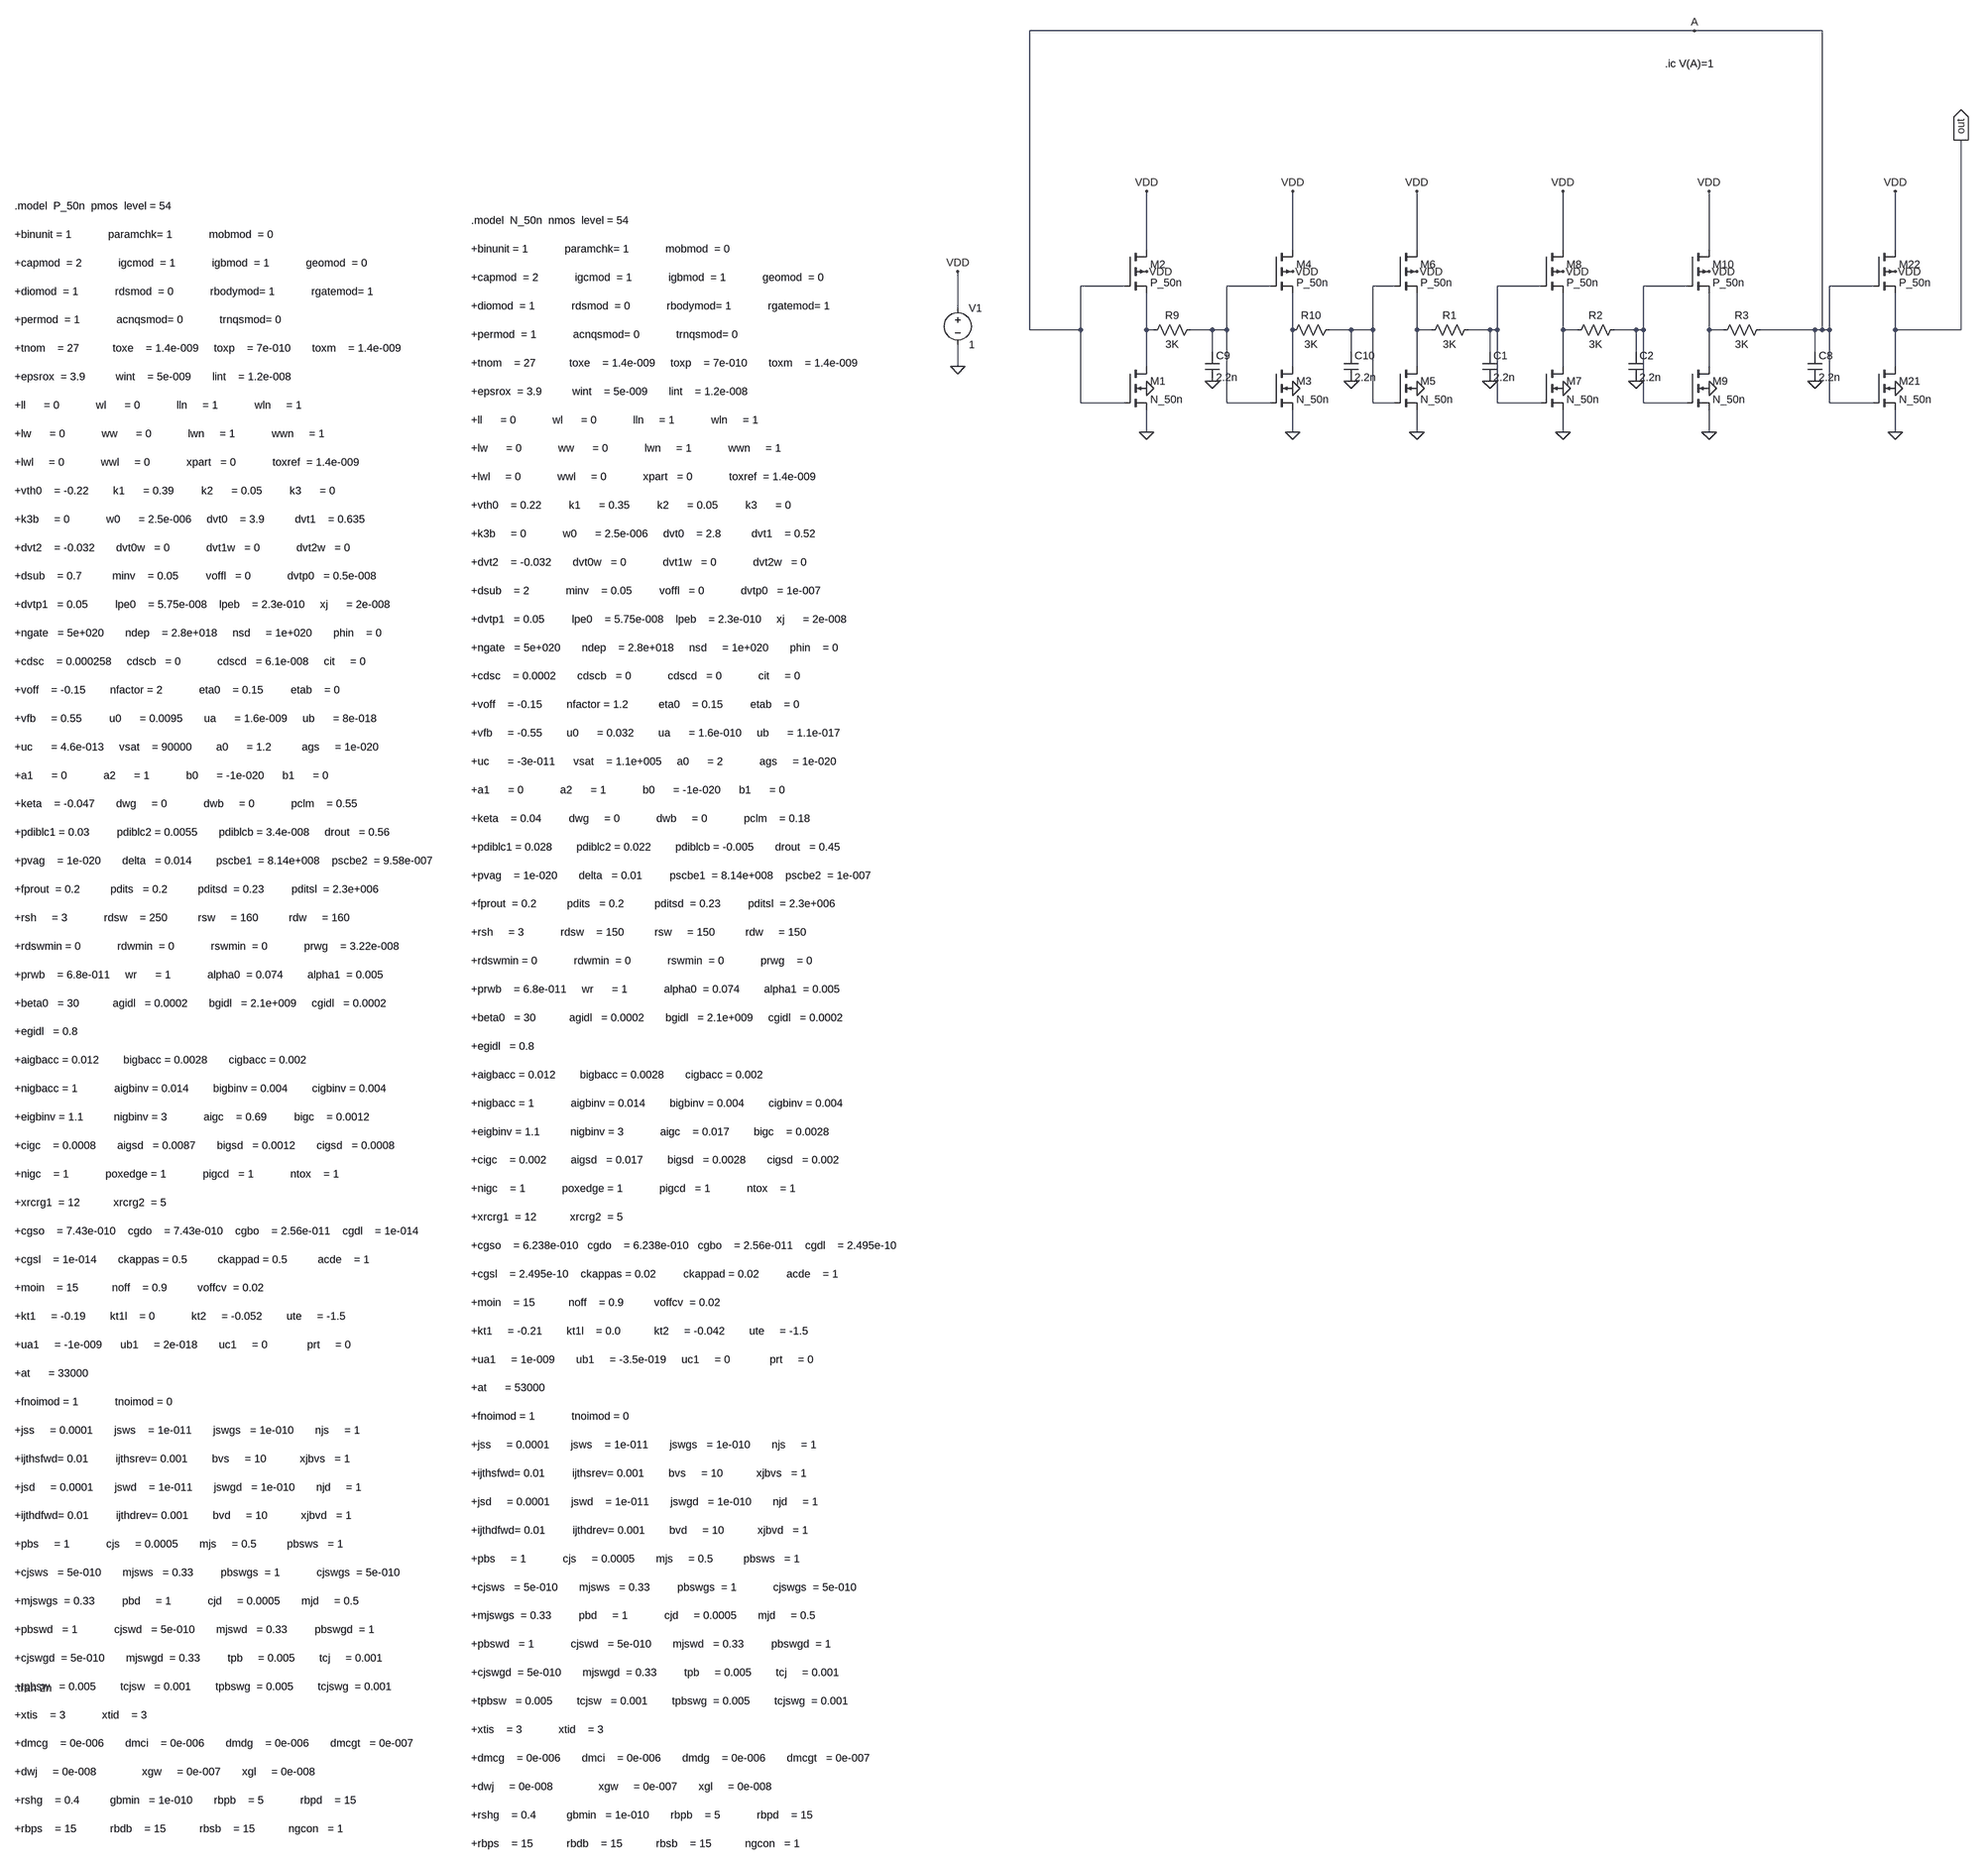
[diagram p0: schematic Draft30.asc]
Draft30.asc, the LTspice schematic file:
Version 4
SHEET 1 4736 3280
WIRE 2672 -368 1216 -368
WIRE 4352 -368 2672 -368
WIRE 1472 112 1472 -16
WIRE 1792 112 1792 -16
WIRE 2064 112 2064 -16
WIRE 2384 112 2384 -16
WIRE 2704 112 2704 -16
WIRE 4512 112 4512 -16
WIRE 1424 192 1328 192
WIRE 1744 192 1648 192
WIRE 2016 192 1968 192
WIRE 2336 192 2240 192
WIRE 2656 192 2560 192
WIRE 4464 192 4368 192
WIRE 1040 240 1040 160
WIRE 1216 288 1216 -368
WIRE 1328 288 1328 192
WIRE 1328 288 1216 288
WIRE 1472 288 1472 208
WIRE 1488 288 1472 288
WIRE 1616 288 1568 288
WIRE 1648 288 1648 192
WIRE 1648 288 1616 288
WIRE 1792 288 1792 208
WIRE 1920 288 1872 288
WIRE 1968 288 1968 192
WIRE 1968 288 1920 288
WIRE 2064 288 2064 208
WIRE 2096 288 2064 288
WIRE 2224 288 2176 288
WIRE 2240 288 2240 192
WIRE 2240 288 2224 288
WIRE 2384 288 2384 208
WIRE 2416 288 2384 288
WIRE 2544 288 2496 288
WIRE 2560 288 2560 192
WIRE 2560 288 2544 288
WIRE 2704 288 2704 208
WIRE 2736 288 2704 288
WIRE 4336 288 2816 288
WIRE 4352 288 4352 -368
WIRE 4352 288 4336 288
WIRE 4368 288 4368 192
WIRE 4368 288 4352 288
WIRE 4512 288 4512 208
WIRE 4656 288 4656 -128
WIRE 4656 288 4512 288
WIRE 1616 336 1616 288
WIRE 1920 336 1920 288
WIRE 2224 336 2224 288
WIRE 2544 336 2544 288
WIRE 4336 336 4336 288
WIRE 1040 368 1040 320
WIRE 1472 368 1472 288
WIRE 1792 368 1792 288
WIRE 2064 368 2064 288
WIRE 2384 368 2384 288
WIRE 2704 368 2704 288
WIRE 4512 368 4512 288
WIRE 1328 448 1328 288
WIRE 1424 448 1328 448
WIRE 1648 448 1648 288
WIRE 1744 448 1648 448
WIRE 1968 448 1968 288
WIRE 2016 448 1968 448
WIRE 2240 448 2240 288
WIRE 2336 448 2240 448
WIRE 2560 448 2560 288
WIRE 2656 448 2560 448
WIRE 4368 448 4368 288
WIRE 4464 448 4368 448
WIRE 1472 512 1472 464
WIRE 1792 512 1792 464
WIRE 2064 512 2064 464
WIRE 2384 512 2384 464
WIRE 2704 512 2704 464
WIRE 4512 512 4512 464
FLAG 1040 368 0
FLAG 1472 512 0
FLAG 1472 416 0
FLAG 1040 160 VDD
FLAG 1472 160 VDD
FLAG 1472 -16 VDD
FLAG 1792 512 0
FLAG 1792 416 0
FLAG 1792 160 VDD
FLAG 1792 -16 VDD
FLAG 2064 512 0
FLAG 2064 416 0
FLAG 2064 160 VDD
FLAG 2064 -16 VDD
FLAG 2384 512 0
FLAG 2384 416 0
FLAG 2384 160 VDD
FLAG 2384 -16 VDD
FLAG 2704 512 0
FLAG 2704 416 0
FLAG 2704 160 VDD
FLAG 2704 -16 VDD
FLAG 4512 512 0
FLAG 4512 416 0
FLAG 4512 160 VDD
FLAG 4512 -16 VDD
FLAG 2672 -368 A
FLAG 2224 400 0
FLAG 2544 400 0
FLAG 4336 400 0
FLAG 1616 400 0
FLAG 1920 400 0
FLAG 4656 -128 out
IOPIN 4656 -128 Out
SYMBOL nmos4 1424 368 R0
SYMATTR InstName M1
SYMATTR Value N_50n
SYMATTR Value2 l=50N w=500N
SYMBOL pmos4 1424 112 R0
SYMATTR InstName M2
SYMATTR Value P_50n
SYMATTR Value2 l=50N w=1U
SYMBOL voltage 1040 224 R0
WINDOW 123 0 0 Left 0
WINDOW 39 0 0 Left 0
SYMATTR InstName V1
SYMATTR Value 1
SYMBOL nmos4 1744 368 R0
SYMATTR InstName M3
SYMATTR Value N_50n
SYMATTR Value2 l=50N w=500N
SYMBOL pmos4 1744 112 R0
SYMATTR InstName M4
SYMATTR Value P_50n
SYMATTR Value2 l=50N w=1U
SYMBOL nmos4 2016 368 R0
SYMATTR InstName M5
SYMATTR Value N_50n
SYMATTR Value2 l=50N w=500N
SYMBOL pmos4 2016 112 R0
SYMATTR InstName M6
SYMATTR Value P_50n
SYMATTR Value2 l=50N w=1U
SYMBOL nmos4 2336 368 R0
SYMATTR InstName M7
SYMATTR Value N_50n
SYMATTR Value2 l=50N w=500N
SYMBOL pmos4 2336 112 R0
SYMATTR InstName M8
SYMATTR Value P_50n
SYMATTR Value2 l=50N w=1U
SYMBOL nmos4 2656 368 R0
SYMATTR InstName M9
SYMATTR Value N_50n
SYMATTR Value2 l=50N w=500N
SYMBOL pmos4 2656 112 R0
SYMATTR InstName M10
SYMATTR Value P_50n
SYMATTR Value2 l=50N w=1U
SYMBOL nmos4 4464 368 R0
SYMATTR InstName M21
SYMATTR Value N_50n
SYMATTR Value2 l=50N w=500N
SYMBOL pmos4 4464 112 R0
SYMATTR InstName M22
SYMATTR Value P_50n
SYMATTR Value2 l=50N w=1U
SYMBOL res 2192 272 R90
WINDOW 0 0 56 VBottom 2
WINDOW 3 32 56 VTop 2
SYMATTR InstName R1
SYMATTR Value 3K
SYMBOL cap 2208 336 R0
SYMATTR InstName C1
SYMATTR Value 2.2n
SYMBOL res 2512 272 R90
WINDOW 0 0 56 VBottom 2
WINDOW 3 32 56 VTop 2
SYMATTR InstName R2
SYMATTR Value 3K
SYMBOL cap 2528 336 R0
SYMATTR InstName C2
SYMATTR Value 2.2n
SYMBOL res 2832 272 R90
WINDOW 0 0 56 VBottom 2
WINDOW 3 32 56 VTop 2
SYMATTR InstName R3
SYMATTR Value 3K
SYMBOL cap 4320 336 R0
SYMATTR InstName C8
SYMATTR Value 2.2n
SYMBOL res 1584 272 R90
WINDOW 0 0 56 VBottom 2
WINDOW 3 32 56 VTop 2
SYMATTR InstName R9
SYMATTR Value 3K
SYMBOL cap 1600 336 R0
SYMATTR InstName C9
SYMATTR Value 2.2n
SYMBOL res 1888 272 R90
WINDOW 0 0 56 VBottom 2
WINDOW 3 32 56 VTop 2
SYMATTR InstName R10
SYMATTR Value 3K
SYMBOL cap 1904 336 R0
SYMATTR InstName C10
SYMATTR Value 2.2n
TEXT -184 48 Left 2 !.model  N_50n  nmos  level = 54\n \n+binunit = 1            paramchk= 1            mobmod  = 0          \n \n+capmod  = 2            igcmod  = 1            igbmod  = 1            geomod  = 0          \n \n+diomod  = 1            rdsmod  = 0            rbodymod= 1            rgatemod= 1          \n \n+permod  = 1            acnqsmod= 0            trnqsmod= 0          \n \n+tnom    = 27           toxe    = 1.4e-009     toxp    = 7e-010       toxm    = 1.4e-009   \n \n+epsrox  = 3.9          wint    = 5e-009       lint    = 1.2e-008   \n \n+ll      = 0            wl      = 0            lln     = 1            wln     = 1          \n \n+lw      = 0            ww      = 0            lwn     = 1            wwn     = 1          \n \n+lwl     = 0            wwl     = 0            xpart   = 0            toxref  = 1.4e-009   \n \n+vth0    = 0.22         k1      = 0.35         k2      = 0.05         k3      = 0          \n \n+k3b     = 0            w0      = 2.5e-006     dvt0    = 2.8          dvt1    = 0.52       \n \n+dvt2    = -0.032       dvt0w   = 0            dvt1w   = 0            dvt2w   = 0          \n \n+dsub    = 2            minv    = 0.05         voffl   = 0            dvtp0   = 1e-007     \n \n+dvtp1   = 0.05         lpe0    = 5.75e-008    lpeb    = 2.3e-010     xj      = 2e-008     \n \n+ngate   = 5e+020       ndep    = 2.8e+018     nsd     = 1e+020       phin    = 0          \n \n+cdsc    = 0.0002       cdscb   = 0            cdscd   = 0            cit     = 0          \n \n+voff    = -0.15        nfactor = 1.2          eta0    = 0.15         etab    = 0          \n \n+vfb     = -0.55        u0      = 0.032        ua      = 1.6e-010     ub      = 1.1e-017   \n \n+uc      = -3e-011      vsat    = 1.1e+005     a0      = 2            ags     = 1e-020     \n \n+a1      = 0            a2      = 1            b0      = -1e-020      b1      = 0          \n \n+keta    = 0.04         dwg     = 0            dwb     = 0            pclm    = 0.18       \n \n+pdiblc1 = 0.028        pdiblc2 = 0.022        pdiblcb = -0.005       drout   = 0.45       \n \n+pvag    = 1e-020       delta   = 0.01         pscbe1  = 8.14e+008    pscbe2  = 1e-007     \n \n+fprout  = 0.2          pdits   = 0.2          pditsd  = 0.23         pditsl  = 2.3e+006   \n \n+rsh     = 3            rdsw    = 150          rsw     = 150          rdw     = 150        \n \n+rdswmin = 0            rdwmin  = 0            rswmin  = 0            prwg    = 0          \n \n+prwb    = 6.8e-011     wr      = 1            alpha0  = 0.074        alpha1  = 0.005      \n \n+beta0   = 30           agidl   = 0.0002       bgidl   = 2.1e+009     cgidl   = 0.0002     \n \n+egidl   = 0.8          \n \n+aigbacc = 0.012        bigbacc = 0.0028       cigbacc = 0.002\n \n+nigbacc = 1            aigbinv = 0.014        bigbinv = 0.004        cigbinv = 0.004\n \n+eigbinv = 1.1          nigbinv = 3            aigc    = 0.017        bigc    = 0.0028\n \n+cigc    = 0.002        aigsd   = 0.017        bigsd   = 0.0028       cigsd   = 0.002\n \n+nigc    = 1            poxedge = 1            pigcd   = 1            ntox    = 1\n \n+xrcrg1  = 12           xrcrg2  = 5          \n \n+cgso    = 6.238e-010   cgdo    = 6.238e-010   cgbo    = 2.56e-011    cgdl    = 2.495e-10     \n \n+cgsl    = 2.495e-10    ckappas = 0.02         ckappad = 0.02         acde    = 1          \n \n+moin    = 15           noff    = 0.9          voffcv  = 0.02       \n \n+kt1     = -0.21        kt1l    = 0.0           kt2     = -0.042        ute     = -1.5\n \n+ua1     = 1e-009       ub1     = -3.5e-019     uc1     = 0             prt     = 0\n \n+at      = 53000\n \n+fnoimod = 1            tnoimod = 0          \n \n+jss     = 0.0001       jsws    = 1e-011       jswgs   = 1e-010       njs     = 1          \n \n+ijthsfwd= 0.01         ijthsrev= 0.001        bvs     = 10           xjbvs   = 1          \n \n+jsd     = 0.0001       jswd    = 1e-011       jswgd   = 1e-010       njd     = 1          \n \n+ijthdfwd= 0.01         ijthdrev= 0.001        bvd     = 10           xjbvd   = 1          \n \n+pbs     = 1            cjs     = 0.0005       mjs     = 0.5          pbsws   = 1          \n \n+cjsws   = 5e-010       mjsws   = 0.33         pbswgs  = 1            cjswgs  = 5e-010     \n \n+mjswgs  = 0.33         pbd     = 1            cjd     = 0.0005       mjd     = 0.5        \n \n+pbswd   = 1            cjswd   = 5e-010       mjswd   = 0.33         pbswgd  = 1          \n \n+cjswgd  = 5e-010       mjswgd  = 0.33         tpb     = 0.005        tcj     = 0.001      \n \n+tpbsw   = 0.005        tcjsw   = 0.001        tpbswg  = 0.005        tcjswg  = 0.001      \n \n+xtis    = 3            xtid    = 3          \n \n+dmcg    = 0e-006       dmci    = 0e-006       dmdg    = 0e-006       dmcgt   = 0e-007     \n \n+dwj     = 0e-008               xgw     = 0e-007       xgl     = 0e-008     \n \n+rshg    = 0.4          gbmin   = 1e-010       rbpb    = 5            rbpd    = 15         \n \n+rbps    = 15           rbdb    = 15           rbsb    = 15           ngcon   = 1
TEXT 2608 -296 Left 2 !.ic V(A)=1
TEXT -1184 16 Left 2 !.model  P_50n  pmos  level = 54\n \n+binunit = 1            paramchk= 1            mobmod  = 0          \n \n+capmod  = 2            igcmod  = 1            igbmod  = 1            geomod  = 0          \n \n+diomod  = 1            rdsmod  = 0            rbodymod= 1            rgatemod= 1          \n \n+permod  = 1            acnqsmod= 0            trnqsmod= 0          \n \n+tnom    = 27           toxe    = 1.4e-009     toxp    = 7e-010       toxm    = 1.4e-009   \n \n+epsrox  = 3.9          wint    = 5e-009       lint    = 1.2e-008   \n \n+ll      = 0            wl      = 0            lln     = 1            wln     = 1          \n \n+lw      = 0            ww      = 0            lwn     = 1            wwn     = 1          \n \n+lwl     = 0            wwl     = 0            xpart   = 0            toxref  = 1.4e-009   \n \n+vth0    = -0.22        k1      = 0.39         k2      = 0.05         k3      = 0          \n \n+k3b     = 0            w0      = 2.5e-006     dvt0    = 3.9          dvt1    = 0.635        \n \n+dvt2    = -0.032       dvt0w   = 0            dvt1w   = 0            dvt2w   = 0          \n \n+dsub    = 0.7          minv    = 0.05         voffl   = 0            dvtp0   = 0.5e-008     \n \n+dvtp1   = 0.05         lpe0    = 5.75e-008    lpeb    = 2.3e-010     xj      = 2e-008     \n \n+ngate   = 5e+020       ndep    = 2.8e+018     nsd     = 1e+020       phin    = 0          \n \n+cdsc    = 0.000258     cdscb   = 0            cdscd   = 6.1e-008     cit     = 0          \n \n+voff    = -0.15        nfactor = 2            eta0    = 0.15         etab    = 0          \n \n+vfb     = 0.55         u0      = 0.0095       ua      = 1.6e-009     ub      = 8e-018     \n \n+uc      = 4.6e-013     vsat    = 90000        a0      = 1.2          ags     = 1e-020     \n \n+a1      = 0            a2      = 1            b0      = -1e-020      b1      = 0          \n \n+keta    = -0.047       dwg     = 0            dwb     = 0            pclm    = 0.55       \n \n+pdiblc1 = 0.03         pdiblc2 = 0.0055       pdiblcb = 3.4e-008     drout   = 0.56       \n \n+pvag    = 1e-020       delta   = 0.014        pscbe1  = 8.14e+008    pscbe2  = 9.58e-007  \n \n+fprout  = 0.2          pdits   = 0.2          pditsd  = 0.23         pditsl  = 2.3e+006   \n \n+rsh     = 3            rdsw    = 250          rsw     = 160          rdw     = 160        \n \n+rdswmin = 0            rdwmin  = 0            rswmin  = 0            prwg    = 3.22e-008  \n \n+prwb    = 6.8e-011     wr      = 1            alpha0  = 0.074        alpha1  = 0.005      \n \n+beta0   = 30           agidl   = 0.0002       bgidl   = 2.1e+009     cgidl   = 0.0002     \n \n+egidl   = 0.8          \n \n+aigbacc = 0.012        bigbacc = 0.0028       cigbacc = 0.002\n \n+nigbacc = 1            aigbinv = 0.014        bigbinv = 0.004        cigbinv = 0.004\n \n+eigbinv = 1.1          nigbinv = 3            aigc    = 0.69         bigc    = 0.0012\n \n+cigc    = 0.0008       aigsd   = 0.0087       bigsd   = 0.0012       cigsd   = 0.0008\n \n+nigc    = 1            poxedge = 1            pigcd   = 1            ntox    = 1\n \n+xrcrg1  = 12           xrcrg2  = 5          \n \n+cgso    = 7.43e-010    cgdo    = 7.43e-010    cgbo    = 2.56e-011    cgdl    = 1e-014     \n \n+cgsl    = 1e-014       ckappas = 0.5          ckappad = 0.5          acde    = 1          \n \n+moin    = 15           noff    = 0.9          voffcv  = 0.02       \n \n+kt1     = -0.19        kt1l    = 0            kt2     = -0.052        ute     = -1.5\n \n+ua1     = -1e-009      ub1     = 2e-018       uc1     = 0             prt     = 0\n \n+at      = 33000\n \n+fnoimod = 1            tnoimod = 0          \n \n+jss     = 0.0001       jsws    = 1e-011       jswgs   = 1e-010       njs     = 1          \n \n+ijthsfwd= 0.01         ijthsrev= 0.001        bvs     = 10           xjbvs   = 1          \n \n+jsd     = 0.0001       jswd    = 1e-011       jswgd   = 1e-010       njd     = 1          \n \n+ijthdfwd= 0.01         ijthdrev= 0.001        bvd     = 10           xjbvd   = 1          \n \n+pbs     = 1            cjs     = 0.0005       mjs     = 0.5          pbsws   = 1          \n \n+cjsws   = 5e-010       mjsws   = 0.33         pbswgs  = 1            cjswgs  = 5e-010     \n \n+mjswgs  = 0.33         pbd     = 1            cjd     = 0.0005       mjd     = 0.5        \n \n+pbswd   = 1            cjswd   = 5e-010       mjswd   = 0.33         pbswgd  = 1          \n \n+cjswgd  = 5e-010       mjswgd  = 0.33         tpb     = 0.005        tcj     = 0.001      \n \n+tpbsw   = 0.005        tcjsw   = 0.001        tpbswg  = 0.005        tcjswg  = 0.001      \n \n+xtis    = 3            xtid    = 3          \n \n+dmcg    = 0e-006       dmci    = 0e-006       dmdg    = 0e-006       dmcgt   = 0e-007     \n \n+dwj     = 0e-008               xgw     = 0e-007       xgl     = 0e-008     \n \n+rshg    = 0.4          gbmin   = 1e-010       rbpb    = 5            rbpd    = 15         \n \n+rbps    = 15           rbdb    = 15           rbsb    = 15           ngcon   = 1
TEXT -1184 3264 Left 2 !.tran 2n

The netlist it stands for:
* Draft30.asc
M1 N005 A 0 0 N_50n l=50N w=500N
M2 VDD A N005 VDD P_50n l=50N w=1U
V1 VDD 0 1
M3 N006 N001 0 0 N_50n l=50N w=500N
M4 VDD N001 N006 VDD P_50n l=50N w=1U
M5 N007 N002 0 0 N_50n l=50N w=500N
M6 VDD N002 N007 VDD P_50n l=50N w=1U
M7 N008 N003 0 0 N_50n l=50N w=500N
M8 VDD N003 N008 VDD P_50n l=50N w=1U
M9 N009 N004 0 0 N_50n l=50N w=500N
M10 VDD N004 N009 VDD P_50n l=50N w=1U
M21 out A 0 0 N_50n l=50N w=500N
M22 VDD A out VDD P_50n l=50N w=1U
R1 N003 N007 3K
C1 N003 0 2.2n
R2 N004 N008 3K
C2 N004 0 2.2n
R3 A N009 3K
C8 A 0 2.2n
R9 N001 N005 3K
C9 N001 0 2.2n
R10 N002 N006 3K
C10 N002 0 2.2n
.model NMOS NMOS
.model PMOS PMOS
.lib standard.mos
.model  N_50n  nmos  level = 54
+binunit = 1            paramchk= 1            mobmod  = 0
+capmod  = 2            igcmod  = 1            igbmod  = 1            geomod  = 0
+diomod  = 1            rdsmod  = 0            rbodymod= 1            rgatemod= 1
+permod  = 1            acnqsmod= 0            trnqsmod= 0
+tnom    = 27           toxe    = 1.4e-009     toxp    = 7e-010       toxm    = 1.4e-009
+epsrox  = 3.9          wint    = 5e-009       lint    = 1.2e-008
+ll      = 0            wl      = 0            lln     = 1            wln     = 1
+lw      = 0            ww      = 0            lwn     = 1            wwn     = 1
+lwl     = 0            wwl     = 0            xpart   = 0            toxref  = 1.4e-009
+vth0    = 0.22         k1      = 0.35         k2      = 0.05         k3      = 0
+k3b     = 0            w0      = 2.5e-006     dvt0    = 2.8          dvt1    = 0.52
+dvt2    = -0.032       dvt0w   = 0            dvt1w   = 0            dvt2w   = 0
+dsub    = 2            minv    = 0.05         voffl   = 0            dvtp0   = 1e-007
+dvtp1   = 0.05         lpe0    = 5.75e-008    lpeb    = 2.3e-010     xj      = 2e-008
+ngate   = 5e+020       ndep    = 2.8e+018     nsd     = 1e+020       phin    = 0
+cdsc    = 0.0002       cdscb   = 0            cdscd   = 0            cit     = 0
+voff    = -0.15        nfactor = 1.2          eta0    = 0.15         etab    = 0
+vfb     = -0.55        u0      = 0.032        ua      = 1.6e-010     ub      = 1.1e-017
+uc      = -3e-011      vsat    = 1.1e+005     a0      = 2            ags     = 1e-020
+a1      = 0            a2      = 1            b0      = -1e-020      b1      = 0
+keta    = 0.04         dwg     = 0            dwb     = 0            pclm    = 0.18
+pdiblc1 = 0.028        pdiblc2 = 0.022        pdiblcb = -0.005       drout   = 0.45
+pvag    = 1e-020       delta   = 0.01         pscbe1  = 8.14e+008    pscbe2  = 1e-007
+fprout  = 0.2          pdits   = 0.2          pditsd  = 0.23         pditsl  = 2.3e+006
+rsh     = 3            rdsw    = 150          rsw     = 150          rdw     = 150
+rdswmin = 0            rdwmin  = 0            rswmin  = 0            prwg    = 0
+prwb    = 6.8e-011     wr      = 1            alpha0  = 0.074        alpha1  = 0.005
+beta0   = 30           agidl   = 0.0002       bgidl   = 2.1e+009     cgidl   = 0.0002
+egidl   = 0.8
+aigbacc = 0.012        bigbacc = 0.0028       cigbacc = 0.002
+nigbacc = 1            aigbinv = 0.014        bigbinv = 0.004        cigbinv = 0.004
+eigbinv = 1.1          nigbinv = 3            aigc    = 0.017        bigc    = 0.0028
+cigc    = 0.002        aigsd   = 0.017        bigsd   = 0.0028       cigsd   = 0.002
+nigc    = 1            poxedge = 1            pigcd   = 1            ntox    = 1
+xrcrg1  = 12           xrcrg2  = 5
+cgso    = 6.238e-010   cgdo    = 6.238e-010   cgbo    = 2.56e-011    cgdl    = 2.495e-10
+cgsl    = 2.495e-10    ckappas = 0.02         ckappad = 0.02         acde    = 1
+moin    = 15           noff    = 0.9          voffcv  = 0.02
+kt1     = -0.21        kt1l    = 0.0           kt2     = -0.042        ute     = -1.5
+ua1     = 1e-009       ub1     = -3.5e-019     uc1     = 0             prt     = 0
+at      = 53000
+fnoimod = 1            tnoimod = 0
+jss     = 0.0001       jsws    = 1e-011       jswgs   = 1e-010       njs     = 1
+ijthsfwd= 0.01         ijthsrev= 0.001        bvs     = 10           xjbvs   = 1
+jsd     = 0.0001       jswd    = 1e-011       jswgd   = 1e-010       njd     = 1
+ijthdfwd= 0.01         ijthdrev= 0.001        bvd     = 10           xjbvd   = 1
+pbs     = 1            cjs     = 0.0005       mjs     = 0.5          pbsws   = 1
+cjsws   = 5e-010       mjsws   = 0.33         pbswgs  = 1            cjswgs  = 5e-010
+mjswgs  = 0.33         pbd     = 1            cjd     = 0.0005       mjd     = 0.5
+pbswd   = 1            cjswd   = 5e-010       mjswd   = 0.33         pbswgd  = 1
+cjswgd  = 5e-010       mjswgd  = 0.33         tpb     = 0.005        tcj     = 0.001
+tpbsw   = 0.005        tcjsw   = 0.001        tpbswg  = 0.005        tcjswg  = 0.001
+xtis    = 3            xtid    = 3
+dmcg    = 0e-006       dmci    = 0e-006       dmdg    = 0e-006       dmcgt   = 0e-007
+dwj     = 0e-008               xgw     = 0e-007       xgl     = 0e-008
+rshg    = 0.4          gbmin   = 1e-010       rbpb    = 5            rbpd    = 15
+rbps    = 15           rbdb    = 15           rbsb    = 15           ngcon   = 1
.ic V(A)=1
.model  P_50n  pmos  level = 54
+binunit = 1            paramchk= 1            mobmod  = 0
+capmod  = 2            igcmod  = 1            igbmod  = 1            geomod  = 0
+diomod  = 1            rdsmod  = 0            rbodymod= 1            rgatemod= 1
+permod  = 1            acnqsmod= 0            trnqsmod= 0
+tnom    = 27           toxe    = 1.4e-009     toxp    = 7e-010       toxm    = 1.4e-009
+epsrox  = 3.9          wint    = 5e-009       lint    = 1.2e-008
+ll      = 0            wl      = 0            lln     = 1            wln     = 1
+lw      = 0            ww      = 0            lwn     = 1            wwn     = 1
+lwl     = 0            wwl     = 0            xpart   = 0            toxref  = 1.4e-009
+vth0    = -0.22        k1      = 0.39         k2      = 0.05         k3      = 0
+k3b     = 0            w0      = 2.5e-006     dvt0    = 3.9          dvt1    = 0.635
+dvt2    = -0.032       dvt0w   = 0            dvt1w   = 0            dvt2w   = 0
+dsub    = 0.7          minv    = 0.05         voffl   = 0            dvtp0   = 0.5e-008
+dvtp1   = 0.05         lpe0    = 5.75e-008    lpeb    = 2.3e-010     xj      = 2e-008
+ngate   = 5e+020       ndep    = 2.8e+018     nsd     = 1e+020       phin    = 0
+cdsc    = 0.000258     cdscb   = 0            cdscd   = 6.1e-008     cit     = 0
+voff    = -0.15        nfactor = 2            eta0    = 0.15         etab    = 0
+vfb     = 0.55         u0      = 0.0095       ua      = 1.6e-009     ub      = 8e-018
+uc      = 4.6e-013     vsat    = 90000        a0      = 1.2          ags     = 1e-020
+a1      = 0            a2      = 1            b0      = -1e-020      b1      = 0
+keta    = -0.047       dwg     = 0            dwb     = 0            pclm    = 0.55
+pdiblc1 = 0.03         pdiblc2 = 0.0055       pdiblcb = 3.4e-008     drout   = 0.56
+pvag    = 1e-020       delta   = 0.014        pscbe1  = 8.14e+008    pscbe2  = 9.58e-007
+fprout  = 0.2          pdits   = 0.2          pditsd  = 0.23         pditsl  = 2.3e+006
+rsh     = 3            rdsw    = 250          rsw     = 160          rdw     = 160
+rdswmin = 0            rdwmin  = 0            rswmin  = 0            prwg    = 3.22e-008
+prwb    = 6.8e-011     wr      = 1            alpha0  = 0.074        alpha1  = 0.005
+beta0   = 30           agidl   = 0.0002       bgidl   = 2.1e+009     cgidl   = 0.0002
+egidl   = 0.8
+aigbacc = 0.012        bigbacc = 0.0028       cigbacc = 0.002
+nigbacc = 1            aigbinv = 0.014        bigbinv = 0.004        cigbinv = 0.004
+eigbinv = 1.1          nigbinv = 3            aigc    = 0.69         bigc    = 0.0012
+cigc    = 0.0008       aigsd   = 0.0087       bigsd   = 0.0012       cigsd   = 0.0008
+nigc    = 1            poxedge = 1            pigcd   = 1            ntox    = 1
+xrcrg1  = 12           xrcrg2  = 5
+cgso    = 7.43e-010    cgdo    = 7.43e-010    cgbo    = 2.56e-011    cgdl    = 1e-014
+cgsl    = 1e-014       ckappas = 0.5          ckappad = 0.5          acde    = 1
+moin    = 15           noff    = 0.9          voffcv  = 0.02
+kt1     = -0.19        kt1l    = 0            kt2     = -0.052        ute     = -1.5
+ua1     = -1e-009      ub1     = 2e-018       uc1     = 0             prt     = 0
+at      = 33000
+fnoimod = 1            tnoimod = 0
+jss     = 0.0001       jsws    = 1e-011       jswgs   = 1e-010       njs     = 1
+ijthsfwd= 0.01         ijthsrev= 0.001        bvs     = 10           xjbvs   = 1
+jsd     = 0.0001       jswd    = 1e-011       jswgd   = 1e-010       njd     = 1
+ijthdfwd= 0.01         ijthdrev= 0.001        bvd     = 10           xjbvd   = 1
+pbs     = 1            cjs     = 0.0005       mjs     = 0.5          pbsws   = 1
+cjsws   = 5e-010       mjsws   = 0.33         pbswgs  = 1            cjswgs  = 5e-010
+mjswgs  = 0.33         pbd     = 1            cjd     = 0.0005       mjd     = 0.5
+pbswd   = 1            cjswd   = 5e-010       mjswd   = 0.33         pbswgd  = 1
+cjswgd  = 5e-010       mjswgd  = 0.33         tpb     = 0.005        tcj     = 0.001
+tpbsw   = 0.005        tcjsw   = 0.001        tpbswg  = 0.005        tcjswg  = 0.001
+xtis    = 3            xtid    = 3
+dmcg    = 0e-006       dmci    = 0e-006       dmdg    = 0e-006       dmcgt   = 0e-007
+dwj     = 0e-008               xgw     = 0e-007       xgl     = 0e-008
+rshg    = 0.4          gbmin   = 1e-010       rbpb    = 5            rbpd    = 15
+rbps    = 15           rbdb    = 15           rbsb    = 15           ngcon   = 1
.tran 2n
.backanno
.end